# Altium schematic sheet Ethernet.SchDoc: Ethernet
size 431 x 279 mm; Author: Alberto Marrone, Christian Schmitz, Leo Walter; DrawnBy: Alberto Marrone, Christian Schmitz, Leo Walter; Engineer: Alberto Marrone, Christian Schmitz, Leo Walter; Revision: V1.0; SheetNumber: 7; Project: PCB Design Final Project
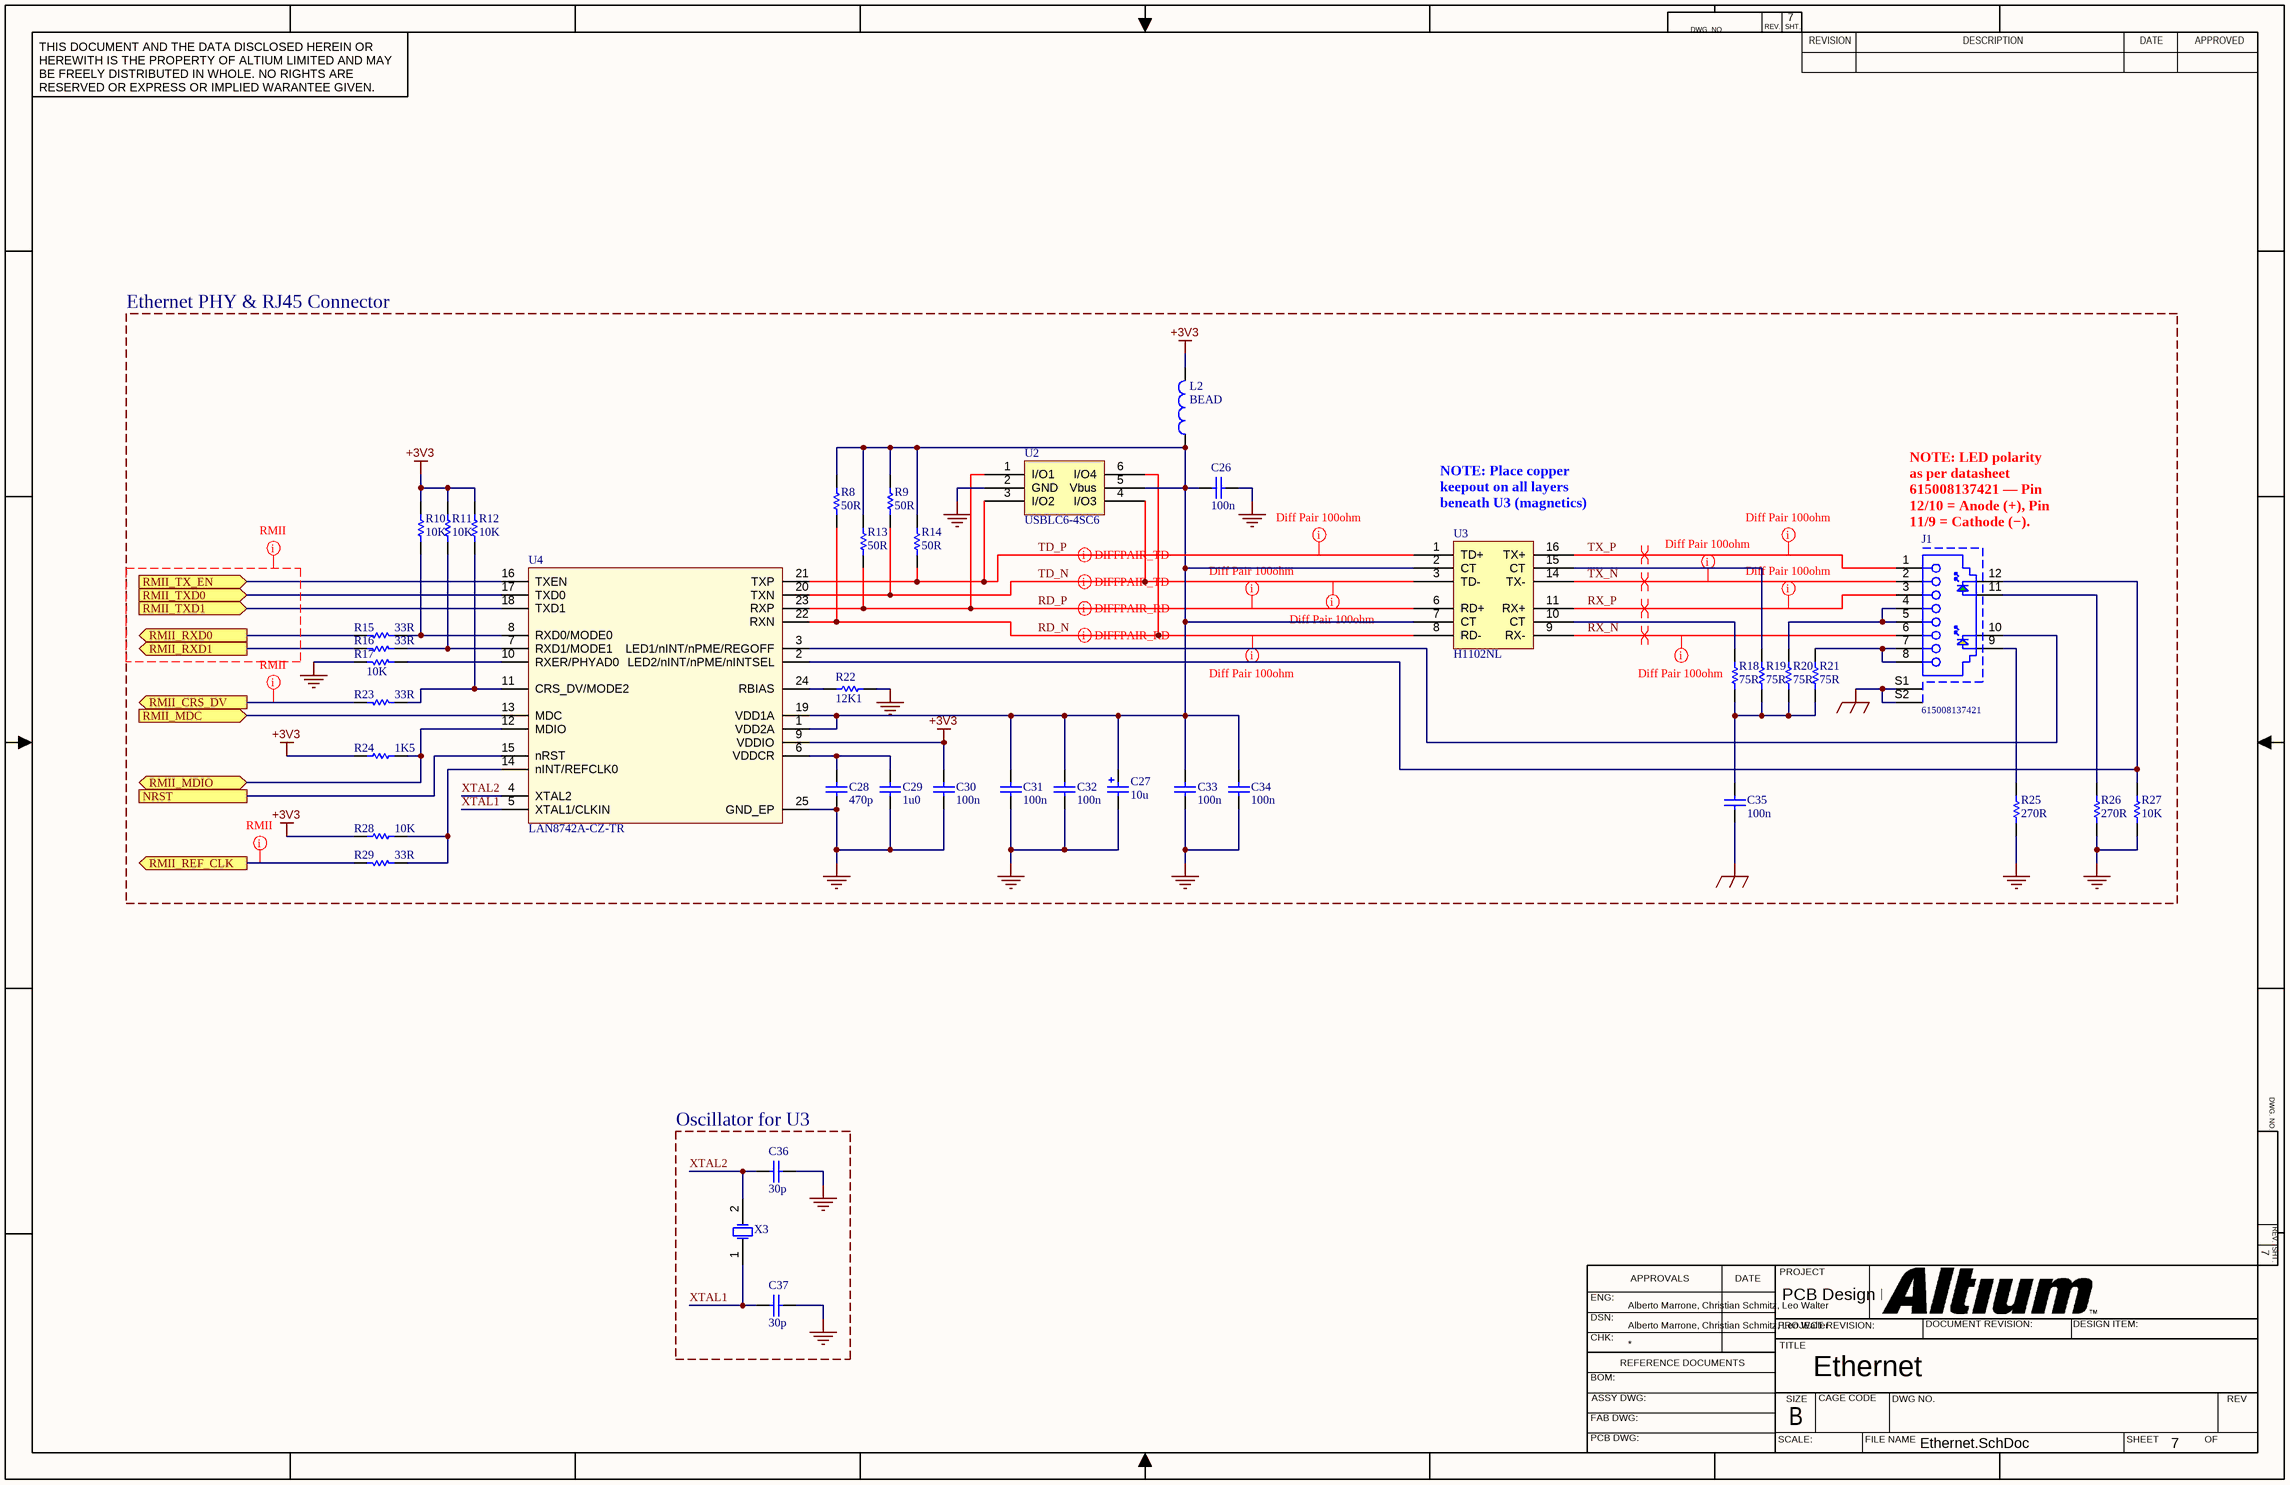
[diagram p0: Ethernet.SchDoc]

## Parts
C26  100n  [0603C]
C27  10u  [TAN-B]
C28  470p  [0603C]
C29  1u0  [0603C]
C30  100n  [0603C]
C31  100n  [0603C]
C32  100n  [0603C]
C33  100n  [0603C]
C34  100n  [0603C]
C35  100n  [0603C]
C36  30p  [0603C]
C37  30p  [0603C]
J1  615008137421  [615008137421]
L2  BEAD  [0603L]
R8  50R  [0603R]
R9  50R  [0603R]
R10  10K  [0603R]
R11  10K  [0603R]
R12  10K  [0603R]
R13  50R  [0603R]
R14  50R  [0603R]
R15  33R  [0603R]
R16  33R  [0603R]
R17  10K  [0603R]
R18  75R  [0603R]
R19  75R  [0603R]
R20  75R  [0603R]
R21  75R  [0603R]
R22  12K1  [0603R]
R23  33R  [0603R]
R24  1K5  [0603R]
R25  270R  [0603R]
R26  270R  [0603R]
R27  10K  [0603R]
R28  10K  [0603R]
R29  33R  [0603R]
U2  USBLC6-4SC6  [SOT23-6L]
U3  H1102NL  [Transformer]
U4  LAN8742A-CZ-TR  [QFN24_0R5_4X4]
X3  ECS-250-12-30Q-JES-TR  [XTAL_2SM_5R0X3R2]  (value not drawn)

## Blocks framed on the sheet
Ethernet PHY & RJ45 Connector: C26-C35 J1 L2 R8-R29 U2-U4
Oscillator for U3: C36 C37 X3

## Ports
NRST, RMII_CRS_DV (out), RMII_MDC (in), RMII_MDIO (bidir), RMII_REF_CLK (out), RMII_RXD0 (out), RMII_RXD1 (out), RMII_TX_EN (in), RMII_TXD0 (in), RMII_TXD1 (in)

## Nets
+3V3: C30.2 L2.2 R10.1 R11.1 R12.1 R24.2 R28.1 U4.9(VDDIO)
EGND: C35.1 J1.S1 J1.S2
GND: C26.1 C27.2 C28.1 C29.2 C30.1 C31.1 C32.1 C33.1 C34.1 C36.2 C37.2 R17.2 R22.2 R25.2 R26.2 R27.2 U2.2(GND) U4.25(GND_EP)
NRST: U4.15(nRST) ; port NRST
RD_N: R8.1 U2.6(I/O4) U3.8(RD-) U4.22(RXN)
RD_P: R13.1 U2.1(I/O1) U3.6(RD+) U4.23(RXP)
RMII_CRS_DV: R23.2 ; port RMII_CRS_DV
RMII_MDC: U4.13(MDC) ; port RMII_MDC
RMII_MDIO: R24.1 U4.12(MDIO) ; port RMII_MDIO
RMII_REF_CLK: R29.2 ; port RMII_REF_CLK
RMII_RXD0: R15.2 ; port RMII_RXD0
RMII_RXD1: R16.2 ; port RMII_RXD1
RMII_TX_EN: U4.16(TXEN) ; port RMII_TX_EN
RMII_TXD0: U4.17(TXD0) ; port RMII_TXD0
RMII_TXD1: U4.18(TXD1) ; port RMII_TXD1
RX_N: J1.6 U3.9(RX-)
RX_P: J1.3 U3.11(RX+)
TD_N: R9.1 U2.4(I/O3) U3.3(TD-) U4.20(TXN)
TD_P: R14.1 U2.3(I/O2) U3.1(TD+) U4.21(TXP)
TX_N: J1.2 U3.14(TX-)
TX_P: J1.1 U3.16(TX+)
XTAL1: C37.1 U4.5(XTAL1/CLKIN) X3.1(OSC1)
XTAL2: C36.1 U4.4(XTAL2) X3.2(OSC2)
NetC26_2: C26.2 C27.1 C31.2 C32.2 C33.2 C34.2 L2.1 R8.2 R9.2 R13.2 R14.2 U2.5(Vbus) U3.2(CT) U3.7(CT) U4.1(VDD2A) U4.19(VDD1A)
NetC28_2: C28.2 C29.1 U4.6(VDDCR)
NetC35_2: C35.2 R18.1 R19.1 R20.1 R21.1
NetJ1_4: J1.4 J1.5 R20.2
NetJ1_7: J1.7 J1.8 R21.2
NetJ1_9: J1.9 R25.1
NetJ1_10: J1.10 U4.3(LED1/nINT/nPME/REGOFF)
NetJ1_11: J1.11 R26.1
NetJ1_12: J1.12 R27.1 U4.2(LED2/nINT/nPME/nINTSEL)
NetR10_2: R10.2 R15.1 U4.8(RXD0/MODE0)
NetR11_2: R11.2 R16.1 U4.7(RXD1/MODE1)
NetR12_2: R12.2 R23.1 U4.11(CRS_DV/MODE2)
NetR17_1: R17.1 U4.10(RXER/PHYAD0)
NetR18_2: R18.2 U3.10(CT)
NetR19_2: R19.2 U3.15(CT)
NetR22_1: R22.1 U4.24(RBIAS)
NetR28_2: R28.2 R29.1 U4.14(nINT/REFCLK0)

## Layout directives
differential pair: RD_N, RD_P, RX_N, RX_P, TD_N, TD_P, TX_N, TX_P
net class ETH_Diff: RD_N, RD_P, RX_N, RX_P, TD_N, TD_P, TX_N, TX_P
net class RMII: (no net found under the mark), RMII_CRS_DV, RMII_REF_CLK

## Notes on the sheet
- (near U3) NOTE: Place copper keepout on all layers beneath U3 (magnetics)
- (near J1) NOTE: LED polarity as per datasheet 615008137421 — Pin 12/10 = Anode (+), Pin 11/9 = Cathode (−). Symbol shows reversed polarity.
- DWG. NO.
- REV.
- SHT.
- THIS DOCUMENT AND THE DATA DISCLOSED HEREIN OR HEREWITH IS THE PROPERTY OF ALTIUM LIMITED AND MAY BE FREELY DISTRIBUTED IN WHOLE. NO RIGHTS ARE RESERVED OR EXPRESS OR IMPLIED WARANTEE GIVEN.
- REVISION
- DESCRIPTION
- DATE
- APPROVED
- ENG:
- APPROVALS
- PROJECT
- DSN:
- CHK:
- REFERENCE DOCUMENTS
- PROJECT REVISION:
- TITLE
- DOCUMENT REVISION:
- DESIGN ITEM:
- BOM:
- FAB DWG:
- PCB DWG:
- ASSY DWG:
- SCALE:
- SIZE
- B
- CAGE CODE
- FILE NAME
- DWG NO.
- SHEET
- OF
- REV

## Library data of the parts
C26 C30-C35 = Cap: Capacitor; Dielectric: X7R; Published: 8-Jun-2000; Revision: July-2002: Re-released for DXP Platform.; Publisher: Altium Limited; Value: 100n
C27 = Cap Pol1: Tantalum Capacitor; Voltage Rating: 25V; Published: 8-Jun-2000; Revision: July-2002: Re-released for DXP Platform.; Publisher: Altium Limited; Value: 10u
C28 C36 C37 = Capacitor_ST: Capacitor 0402 / 0603 / 0805; Revision: July-2002: Re-released for DXP Platform.
  C28: Value: 470p
  C36 C37: Value: 30p
C29 = CAP SMD 0603  X5R 1µF 25V 10%: Capacitor; Voltage Rating: 25V; Tolerance: 10%; Dielectric: X5R; Manufacturer: *; Manufacturer P/N: *; Order code Farnell: 1288202RL; Value: 1u0; Power: *; Temperature  Factor: *; Temperature Max: +125°C; Temperature Min: -55°C; STS Code: *
J1 = CMP-1502-01697-1: Modular Jack WR-MJ, Tab Up, Shielded, with LED and EMI Panel Finger, Horizontal Entry, THT, 8P8C; Manufacturer: Wurth Elektronik; Compliance: Leadfree/RoHS; Withstanding Voltage: 1000VAC; Port: 1x1; Contact Resistance: 20mOhm; Rated Current: 1.5A; Working Voltage: 120VAC; Manufacturer URL: http://www.we-online.de; Mounting Technology: THT; Entrance: Horizontal; Datasheet URL: https://katalog.we-online.de/em/datasheet/615008137421.pdf; Packaging: Tray; Package Reference: 615008137421; Publisher: WurthElektronik; Operating Temperature: -40to85degC; Part Number: 615008137421; Pin Number: 8P8C
L2 = Inductor: Value: 100uH; Published: 8-Jun-2000; Revision: July-2002: Re-released for DXP Platform.; Publisher: Altium Limited
R8 R9 R13 R14 = Res_50_1%_0603: Resistor,50,0603,1%,YAGEO; Manuf_Part_1: RC0402FR-0750RL; Value: 50R; Manuf_1: YAGEO; Order: *; ECCN_US/EU: n/a; Distrib: FARNELL
R10-R12 R17 R27 R28 = res1: Resistor; Published: 8-Jun-2000; Revision: July-2002: Re-released for DXP Platform.; Publisher: Altium Limited; Value: 10K
R15 R16 R23 R29 = res1: Resistor; Tolerance: 1%; Published: 8-Jun-2000; Revision: July-2002: Re-released for DXP Platform.; Publisher: Altium Limited; Value: 33R
R18-R21 = Res_75_1%_0603: Resistor; Manuf_Part_1: RC0402FR-0750RL; Manuf_1: YAGEO; Tolerance: 1%; Value: 75R; Order: *; ECCN_US/EU: n/a; Distrib: FARNELL
R22 = Res_12K1_1%_0603: Resistor,12K1,0603,1%,VISHAY; Manuf_Part_1: MCT 0603-50 1% P5 12K1; Order: 2325243; Value: 12K1; ECCN_US/EU: n/a; Manuf_1: VISHAY; Distrib: FARNELL
R24 = Res_1K5_1%_0402: Resistor,1K5,0402,1%,YAGEO; Manuf_Part_1: RC0402FR-071K5L; Value: 1K5; Manuf_1: YAGEO; Order: RC0402FR-071K5L; ECCN_US/EU: n/a; Distrib: FARNELL
R25 R26 = Resistor_ST: Resistor 0402 / 0603 / 0805; Value: 270R
U3 = KMS-1102NL: replaces the KMS-1102NL
U4 = LAN8742A-CZ-TR: LAN8742A-CZ-TR - Small Footprint RMII 10/100 Ethernet, Transceiver with HP Auto-MDIX and flexPWR Technology SQFN-24; Manuf_1: MICROCHIP; Order: LAN8742A-CZ-TR; Manuf_Part_1: LAN8742A-CZ-TR; Distrib: MICROCHIP; Supplier 1: Farnell; Supplier Part Number 1: LAN8742A-CZ-TR
X3 = XTAL_5032: Crystal Oscillator; Published: 8-Jun-2000; LatestRevisionDate: 17-Jul-2002; LatestRevisionNote: Re-released for DXP Platform.; PackageReference: R38; Publisher: Altium Limited